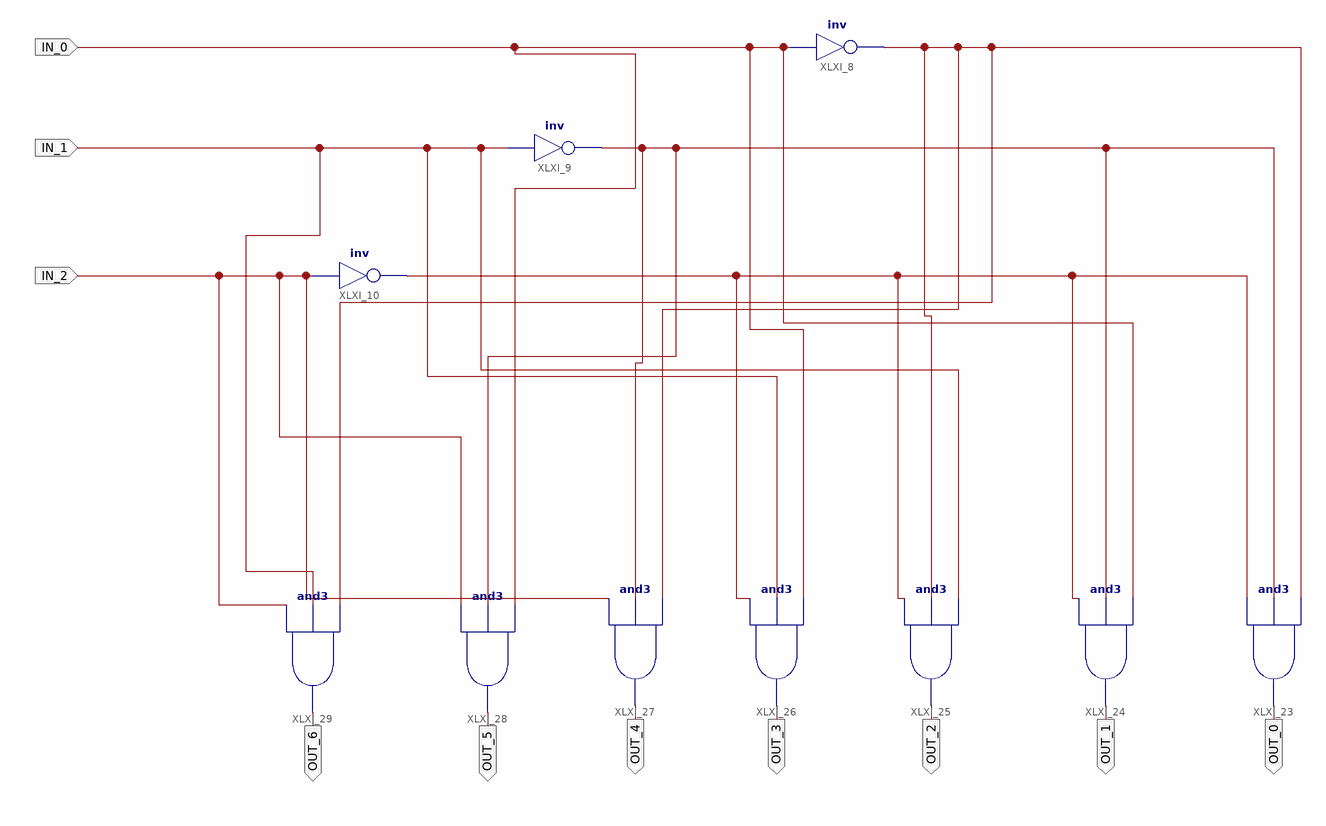
[diagram p0: schematic sheet 1]
// Xilinx ISE schematic My3To7Decoder.sch (spartan3a) as structural Verilog: 10 symbols, 10 ports
module My3To7Decoder (
  input  IN_1,
  input  IN_0,
  input  IN_2,
  output OUT_6,
  output OUT_5,
  output OUT_4,
  output OUT_3,
  output OUT_2,
  output OUT_1,
  output OUT_0
);

  wire XLXN_42, XLXN_47, XLXN_49;

  not XLXI_8 (XLXN_49, IN_0);
  not XLXI_9 (XLXN_47, IN_1);
  not XLXI_10 (XLXN_42, IN_2);
  and XLXI_23 (OUT_0, XLXN_42, XLXN_47, XLXN_49);
  and XLXI_24 (OUT_1, XLXN_42, XLXN_47, IN_0);
  and XLXI_25 (OUT_2, XLXN_42, XLXN_49, IN_1);
  and XLXI_26 (OUT_3, XLXN_42, IN_1, IN_0);
  and XLXI_27 (OUT_4, IN_2, XLXN_47, XLXN_49);
  and XLXI_28 (OUT_5, IN_2, XLXN_47, IN_0);
  and XLXI_29 (OUT_6, IN_2, IN_1, XLXN_49);
endmodule
